# EAGLE design PicoKbd (EAGLE 6.5.0)
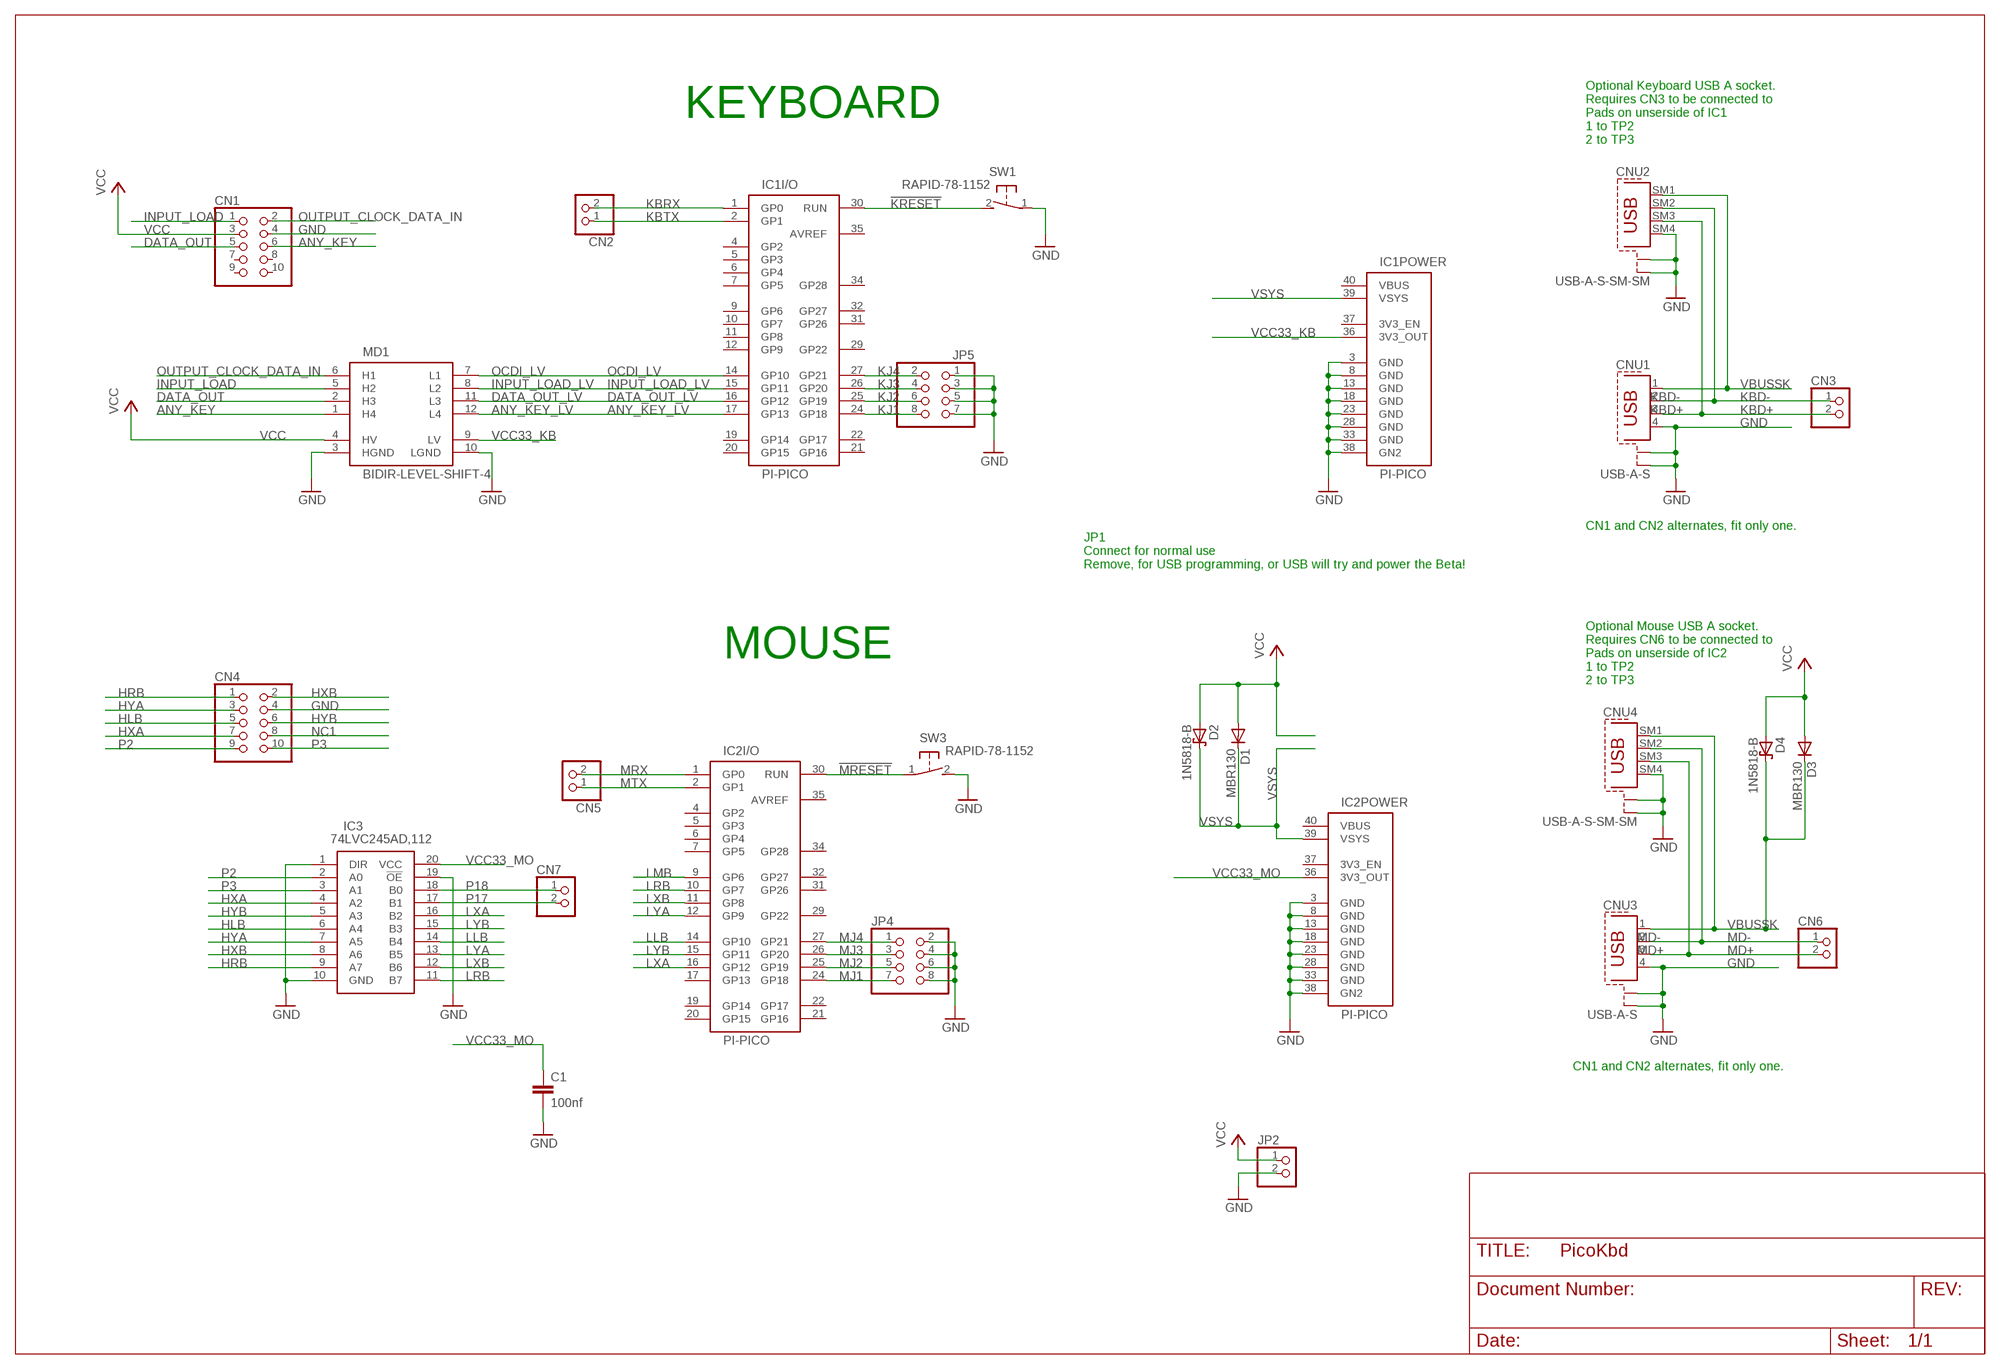
[diagram p0: schematic, sheet 1]

## Parts
C1  100nf  C-EU025-025X050  [C025-025X050]
CN1  PINHD-2X5/90  [2X05/90]
CN2  PINHD-1X2  [1X02]
CN3  PINHD-1X2  [1X02]
CN4  PINHD-2X5/90  [2X05/90]
CN5  PINHD-1X2  [1X02]
CN6  PINHD-1X2  [1X02]
CN7  PINHD-1X2  [1X02]
CNU1  USB-A-S  [USB-A-SHIELD-PTH]
CNU2  USB-A-S-SM-SM  [USB-A-SHIELD-SM]
CNU3  USB-A-S  [USB-A-SHIELD-PTH]
CNU4  USB-A-S-SM-SM  [USB-A-SHIELD-SM]
D1  MBR130  MBR0520LT  [SOD123]
D2  1N5818-B  [DO41-7.6]
D3  MBR130  MBR0520LT  [SOD123]
D4  1N5818-B  [DO41-7.6]
IC1  PI-PICO  [PI-PICO-MAIN]
IC2  PI-PICO  [PI-PICO-MAIN]
IC3  74LVC245AD,112  [SOIC127P1032X265-20N]
JP2  PINHD-1X2/90  [1X02/90]
JP4  PINHD-2X4  [2X04]
JP5  PINHD-2X4  [2X04]
MD1  BIDIR-LEVEL-SHIFT-4  [BIDIR-LEVEL-SHIFT]
SW1  RAPID-78-1152  [B3F-31XX]
SW3  RAPID-78-1152  [B3F-31XX]

## Nets
!KRESET: IC1.30(I/O:RUN) SW1.2(S)
!MRESET: IC2.30(I/O:RUN) SW3.1(P)
ANY_KEY: CN1.6 MD1.1(H4)
ANY_KEY_LV: IC1.17(I/O:GP13) MD1.12(L4)
DATA_OUT: CN1.5 MD1.2(H3)
DATA_OUT_LV: IC1.16(I/O:GP12) MD1.11(L3)
GND: C1.2 CN1.4 CN4.4 CNU1.4 CNU1.S1 CNU1.S2 CNU2.S1 CNU2.S2 CNU2.SM4 CNU3.4 CNU3.S1 CNU3.S2 CNU4.S1 CNU4.S2 CNU4.SM4 IC1.3(POWER:GND) IC1.8(POWER:GND) IC1.13(POWER:GND) IC1.18(POWER:GND) IC1.23(POWER:GND) IC1.28(POWER:GND) IC1.33(POWER:GND) IC1.38(POWER:GN2) IC2.3(POWER:GND) IC2.8(POWER:GND) IC2.13(POWER:GND) IC2.18(POWER:GND) IC2.23(POWER:GND) IC2.28(POWER:GND) IC2.33(POWER:GND) IC2.38(POWER:GN2) IC3.1(DIR) IC3.10(GND) IC3.19(!OE) JP2.2 JP4.2 JP4.4 JP4.6 JP4.8 JP5.1 JP5.3 JP5.5 JP5.7 MD1.3(HGND) MD1.10(LGND) SW1.1(P) SW3.2(S)
HLB: CN4.5 IC3.6(A4)
HRB: CN4.1 IC3.9(A7)
HXA: CN4.7 IC3.4(A2)
HXB: CN4.2 IC3.8(A6)
HYA: CN4.3 IC3.7(A5)
HYB: CN4.6 IC3.5(A3)
INPUT_LOAD: CN1.1 MD1.5(H2)
INPUT_LOAD_LV: IC1.15(I/O:GP11) MD1.8(L2)
KBD+: CN3.2 CNU1.3 CNU2.SM3
KBD-: CN3.1 CNU1.2 CNU2.SM2
KBRX: CN2.2 IC1.1(I/O:GP0)
KBTX: CN2.1 IC1.2(I/O:GP1)
KJ1: IC1.24(I/O:GP18) JP5.8
KJ2: IC1.25(I/O:GP19) JP5.6
KJ3: IC1.26(I/O:GP20) JP5.4
KJ4: IC1.27(I/O:GP21) JP5.2
LLB: IC2.14(I/O:GP10) IC3.14(B4)
LMB: IC2.9(I/O:GP6)
LRB: IC2.10(I/O:GP7) IC3.11(B7)
LXA: IC2.16(I/O:GP12) IC3.16(B2)
LXB: IC2.11(I/O:GP8) IC3.12(B6)
LYA: IC2.12(I/O:GP9) IC3.13(B5)
LYB: IC2.15(I/O:GP11) IC3.15(B3)
MD+: CN6.2 CNU3.3 CNU4.SM3
MD-: CN6.1 CNU3.2 CNU4.SM2
MJ1: IC2.24(I/O:GP18) JP4.7
MJ2: IC2.25(I/O:GP19) JP4.5
MJ3: IC2.26(I/O:GP20) JP4.3
MJ4: IC2.27(I/O:GP21) JP4.1
MRX: CN5.2 IC2.1(I/O:GP0)
MTX: CN5.1 IC2.2(I/O:GP1)
NC1: CN4.8
OCDI_LV: IC1.14(I/O:GP10) MD1.7(L1)
OUTPUT_CLOCK_DATA_IN: CN1.2 MD1.6(H1)
P2: CN4.9 IC3.2(A0)
P3: CN4.10 IC3.3(A1)
P17: CN7.2 IC3.17(B1)
P18: CN7.1 IC3.18(B0)
VBUSSK: CNU1.1 CNU2.SM1 CNU3.1 CNU4.SM1 D3.C D4.C
VCC: CN1.3 D1.A D2.A D3.A D4.A JP2.1 MD1.4(HV)
VCC33_KB: IC1.36(POWER:3V3_OUT) MD1.9(LV)
VCC33_MO: C1.1 IC2.36(POWER:3V3_OUT) IC3.20(VCC)
VSYS: D1.C D2.C IC1.39(POWER:VSYS) IC2.39(POWER:VSYS)
Unconnected: CN1.7 CN1.8 CN1.9 CN1.10 IC1.4(I/O:GP2) IC1.5(I/O:GP3) IC1.6(I/O:GP4) IC1.7(I/O:GP5) IC1.9(I/O:GP6) IC1.10(I/O:GP7) IC1.11(I/O:GP8) IC1.12(I/O:GP9) IC1.19(I/O:GP14) IC1.20(I/O:GP15) IC1.21(I/O:GP16) IC1.22(I/O:GP17) IC1.29(I/O:GP22) IC1.31(I/O:GP26) IC1.32(I/O:GP27) IC1.34(I/O:GP28) IC1.35(I/O:AVREF) IC1.37(POWER:3V3_EN) IC1.40(POWER:VBUS) IC2.4(I/O:GP2) IC2.5(I/O:GP3) IC2.6(I/O:GP4) IC2.7(I/O:GP5) IC2.17(I/O:GP13) IC2.19(I/O:GP14) IC2.20(I/O:GP15) IC2.21(I/O:GP16) IC2.22(I/O:GP17) IC2.29(I/O:GP22) IC2.31(I/O:GP26) IC2.32(I/O:GP27) IC2.34(I/O:GP28) IC2.35(I/O:AVREF) IC2.37(POWER:3V3_EN) IC2.40(POWER:VBUS) SW1.3(BD1) SW1.4(BD2) SW3.3(BD1) SW3.4(BD2)

## Notes on the sheet
- KEYBOARD
- Optional Keyboard USB A socket.
  Requires CN3 to be connected to 
  Pads on unserside of IC1
  1 to TP2
  2 to TP3
- CN1 and CN2 alternates, fit only one.
- JP1
  Connect for normal use
  Remove, for USB programming, or USB will try and power the Beta!
- MOUSE
- Optional Mouse USB A socket.
  Requires CN6 to be connected to 
  Pads on unserside of IC2
  1 to TP2
  2 to TP3
- CN1 and CN2 alternates, fit only one.

## Library data of the parts
C1 = rcl:C-EU: CAPACITOR, European symbol
CN1 CN4 = pinhead-round:PINHD-2X5: PIN HEADER
CN2 CN3 CN5-CN7 JP2 = pinhead-round:PINHD-1X2: PIN HEADER
CNU1 CNU3 = Con-usb:USB-A-S
CNU2 CNU4 = Con-usb:USB-A-S-SM
D1 D3 = diode:MBR0520LT: SCHOTTKY BARRIER RECTIFIER Source: http://onsemi.com .. MBR0520LT1-D.pdf
D2 D4 = diode:1N581*: 1.0A SCHOTTKY BARRIER RECTIFIER Source: http://www.diodes.com/datasheets/ds23001.pdf
IC1 IC2 = RapberryPi:PI-PICO
IC3 = SamacSys_Parts:74LVC245AD,112: NXP 74LVC245AD,112, Bus Transceiver, 8-Bit Non-Inverting LVTTL, 1.2 3.6 V, 20-Pin SOIC Source: Datasheet <http://uk.rs-online.com/web/p/products/3800279P>; DESCRIPTION: NXP 74LVC245AD,112, Bus Transceiver, 8-Bit Non-Inverting LVTTL, 1.2 3.6 V, 20-Pin SOIC; HEIGHT: 2.65mm; MANUFACTURER_NAME: Nexperia; MANUFACTURER_PART_NUMBER: 74LVC245AD,112; RS_PART_NUMBER: 3800279P; RS_PRICE-STOCK: http://uk.rs-online.com/web/p/products/3800279P
JP4 JP5 = pinhead-round:PINHD-2X4: PIN HEADER
MD1 = Misc:BIDIR-LEVEL-SHIFT-4: 4 Channel bidirectional level shifter
SW1 SW3 = Switches_phs:RAPID-78-1152

## Board
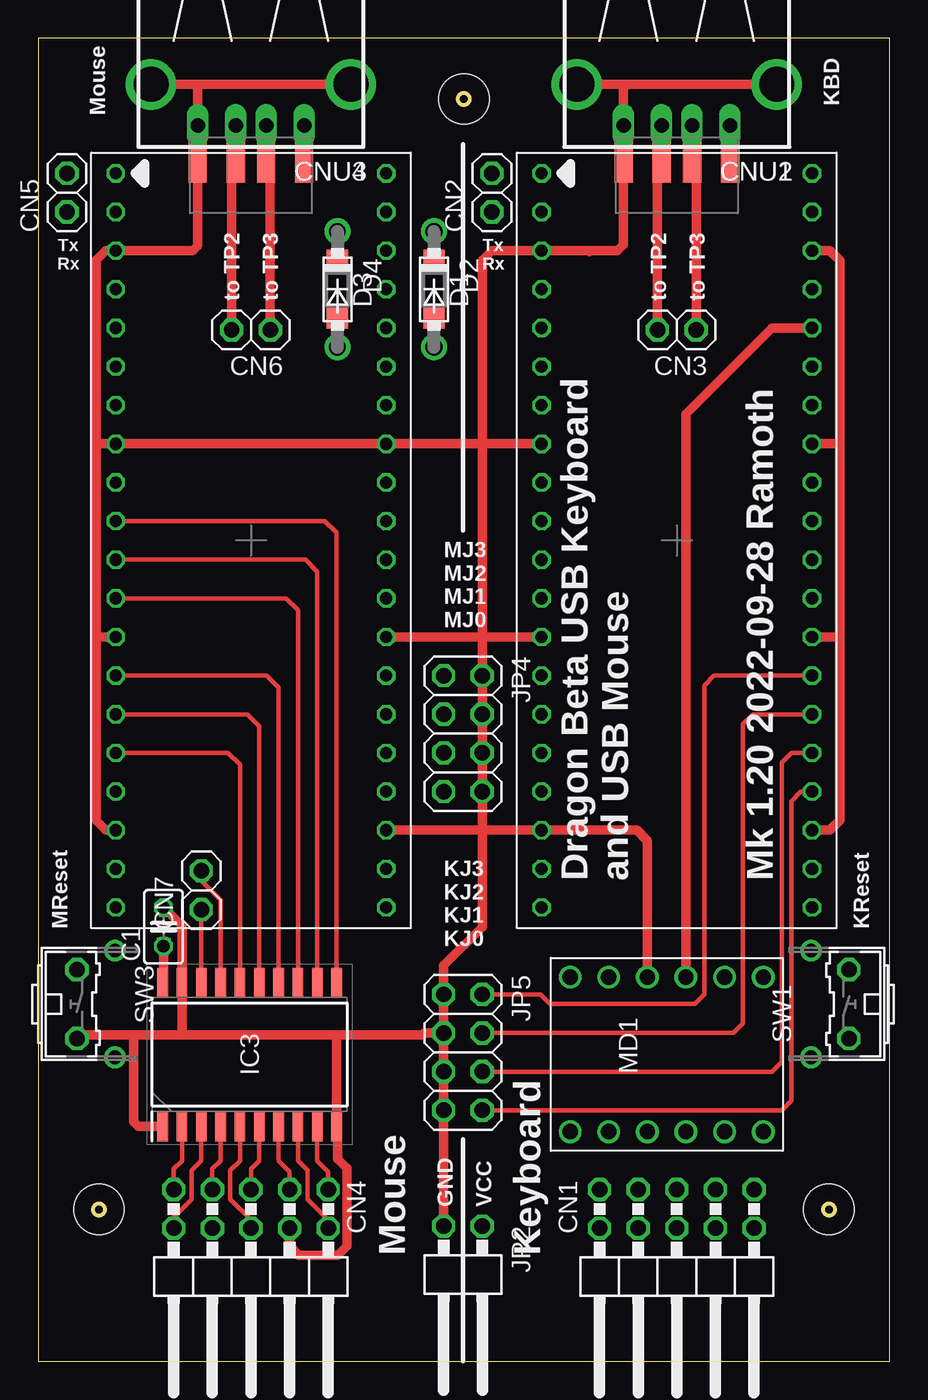
[diagram p1: board, top side]
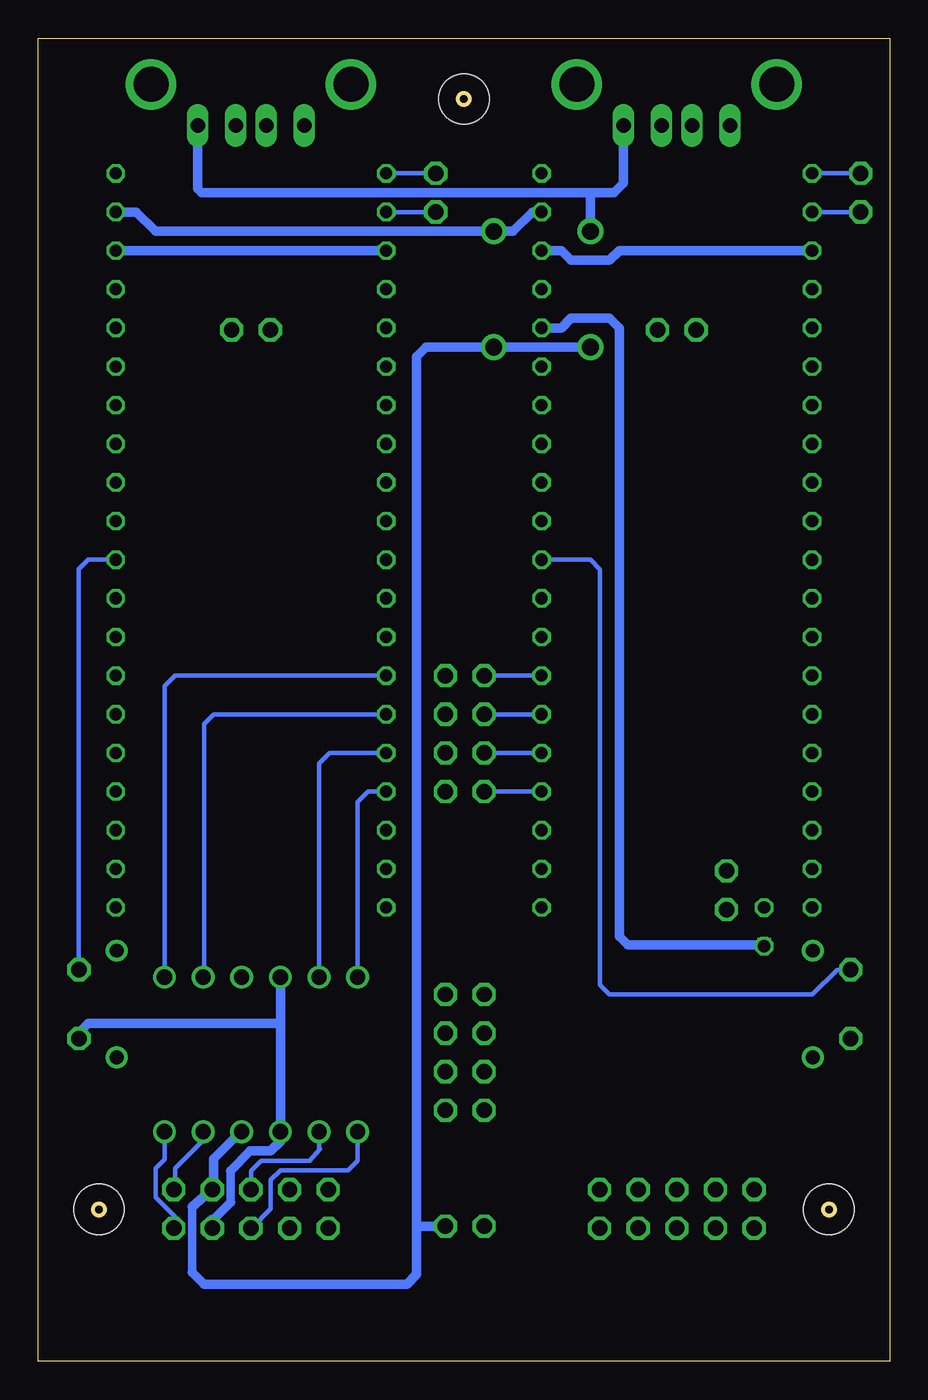
[diagram p2: board, bottom side, seen from below]

Size 56 x 87 mm. Coordinates in mm from the lower left corner, seen from the top.
Outline: 0,0 56,0 56,87 0,87 0,0
Copper layers (1*16): Top 0.035559375mm / dielectric 1.6mm / Bottom 0.035559375mm
Design rules "oshpark-2layer": minimum track width 6mil, minimum drill 10mil, track to track 6mil, track to pad 6mil, pad to pad 6mil, via to via 6mil, smd to smd 6mil, copper to edge 15mil, drill to drill 6mil, minimum pad ring 5mil, minimum via ring 5mil, stop-mask expansion 2.5mil, vias tented up to drill 0mil, thermal gap 10mil

### Footprints (pad centres in the part's own frame; a part is rotated, then mirrored left to right if it is on the bottom)
C025-025X050 = drill 0.813 octagon: 1 -1.27,0; 2 1.27,0
2X05/90 = drill 1.016 octagon: 1 -5.08,-6.35; 2 -5.08,-3.81; 3 -2.54,-6.35; 4 -2.54,-3.81; 5 0,-6.35; 6 0,-3.81; 7 2.54,-6.35; 8 2.54,-3.81; 9 5.08,-6.35; 10 5.08,-3.81
1X02 = drill 1.016 octagon: 1 -1.27,0; 2 1.27,0
USB-A-SHIELD-PTH = drill 0.95 long: 1 -3.5,5.25; 2 -1,5.25; 3 1,5.25; 4 3.5,5.25 | drill 2.3 pad 2.9: S1 -6.57,2.54; S2 6.57,2.54
USB-A-SHIELD-SM = drill 2.3 pad 2.9: S1 -6.57,2.54; S2 6.57,2.54 | smd 1.2 x 3: SM1 -3.5,7.5; SM2 -1,7.5; SM3 1,7.5; SM4 3.5,7.5
SOD123 = smd 1.4 x 1.4: A 1.9,0; C -1.9,0
DO41-7.6 = drill 1.1 pad 1.7: A 3.81,0; C -3.81,0
PI-PICO-MAIN = drill 0.8 octagon: 1 -24.13,-8.89; 2 -21.59,-8.89; 3 -19.05,-8.89; 4 -16.51,-8.89; 5 -13.97,-8.89; 6 -11.43,-8.89; 7 -8.89,-8.89; 8 -6.35,-8.89; 9 -3.81,-8.89; 10 -1.27,-8.89; 11 1.27,-8.89; 12 3.81,-8.89; 13 6.35,-8.89; 14 8.89,-8.89; 15 11.43,-8.89; 16 13.97,-8.89; 17 16.51,-8.89; 18 19.05,-8.89; 19 21.59,-8.89; 20 24.13,-8.89; 21 24.13,8.89; 22 21.59,8.89; 23 19.05,8.89; 24 16.51,8.89; 25 13.97,8.89; 26 11.43,8.89; 27 8.89,8.89; 28 6.35,8.89; 29 3.81,8.89; 30 1.27,8.89; 31 -1.27,8.89; 32 -3.81,8.89; 33 -6.35,8.89; 34 -8.89,8.89; 35 -11.43,8.89; 36 -13.97,8.89; 37 -16.51,8.89; 38 -19.05,8.89; 39 -21.59,8.89; 40 -24.13,8.89
SOIC127P1032X265-20N = smd 1.95 x 0.7: 1 -4.725,5.715; 2 -4.725,4.445; 3 -4.725,3.175; 4 -4.725,1.905; 5 -4.725,0.635; 6 -4.725,-0.635; 7 -4.725,-1.905; 8 -4.725,-3.175; 9 -4.725,-4.445; 10 -4.725,-5.715; 11 4.725,-5.715; 12 4.725,-4.445; 13 4.725,-3.175; 14 4.725,-1.905; 15 4.725,-0.635; 16 4.725,0.635; 17 4.725,1.905; 18 4.725,3.175; 19 4.725,4.445; 20 4.725,5.715
1X02/90 = drill 1.016 octagon: 1 -1.27,-3.81; 2 1.27,-3.81
2X04 = drill 1.016 octagon: 1 -3.81,-1.27; 2 -3.81,1.27; 3 -1.27,-1.27; 4 -1.27,1.27; 5 1.27,-1.27; 6 1.27,1.27; 7 3.81,-1.27; 8 3.81,1.27
BIDIR-LEVEL-SHIFT = drill 1: 1 -5.08,6.35; 2 -5.08,3.81; 3 -5.08,1.27; 4 -5.08,-1.27; 5 -5.08,-3.81; 6 -5.08,-6.35; 7 5.08,-6.35; 8 5.08,-3.81; 9 5.08,-1.27; 10 5.08,1.27; 11 5.08,3.81; 12 5.08,6.35
B3F-31XX = drill 1.016 octagon: 1 -2.261,-1.245; 2 2.261,-1.245 | drill 0.9 pad 1.422: 3 -3.505,1.245; 4 3.505,1.245
STAND-OFF = hole 3.302: 0,0

### Placement (x,y rotation side)
C1  8.26,28.57 90 top
CN1  42,4.95 180 top
CN2  29.84,76.83 90 top
CN3  42,67.81 180 top
CN4  14,4.95 180 top
CN5  1.91,76.83 90 top
CN6  14,67.81 180 top
CN7  10.73,30.98 90 top
CNU1  42,86.5 180 top
CNU2  42,86.5 180 top
CNU3  14,86.5 180 top
CNU4  14,86.5 180 top
D1  26.04,70.48 270 top
D2  26.04,70.48 270 top
D3  19.68,70.48 270 top
D4  19.68,70.48 270 top
IC1  42,53.98 270 top
IC2  14,53.98 270 top
IC3  13.91,20.18 90 top
JP2  27.94,5.08 180 top
JP4  27.94,41.27 270 top
JP5  27.94,20.32 270 top
MD1  41.34,20.18 90 top
SW1  52.07,23.5 90 top
SW3  3.81,23.5 270 top
U$1  [STAND-OFF]  4,10 0 top
U$3  [STAND-OFF]  52,10 0 top
U$4  [STAND-OFF]  28,83 0 top

### Tracks (layer width: path | path; a pad name or v marks a point on that pad's centre or on a via)
!KRESET
  Bottom 0.305: SW1.2 53.31,52.09 52.7,52.7 IC1.30
!MRESET
  Bottom 0.305: SW3.1 3.45,25.76 5.08,24.13 18.41,24.13 19.05,24.77 19.05,52.07 19.68,52.7 IC2.30
ANY_KEY
  Bottom 0.305: CN1.6 41.97,8.76 40.7,10.03 40.7,11.93 40.06,12.56 35.62,12.56 34.98,13.2 MD1.1
ANY_KEY_LV
  Bottom 0.305: MD1.12 34.98,36.77 34.29,37.47 IC1.17
DATA_OUT
  Bottom 0.305: CN1.5 42,12.54 41.34,13.2 38.16,13.2 37.47,13.97 37.52,14.03 MD1.2
DATA_OUT_LV
  Bottom 0.305: IC1.16 36.83,40.01 37.52,39.31 MD1.11
GND
  Top 0.61: 19.62,21.45 IC3.10 19.68,15.4 19.68,13.34 20.32,12.7 20.32,7.62 19.68,6.99 17.14,6.99 16.54,7.59 CN4.4 | 19.62,21.45 9.46,21.45 | 9.46,21.45 IC3.19 9.46,28.64 C1.2 | 9.46,21.45 6.29,21.45 | IC3.1 6.57,15.46 6.29,15.74 6.29,21.45 | CNU2.S2 38.8,83.96 | 38.8,83.96 CNU2.S1 | 38.8,83.96 38.5,83.67 CNU1.4 CNU2.SM4 38.5,73.42 38.1,73.03 36.2,73.03 | CNU4.S2 10.73,83.96 | 10.73,83.96 CNU4.S1 | 10.73,83.96 10.5,83.72 CNU3.4 CNU4.SM4 10.5,73.36 10.16,73.03 IC2.3 4.45,73.03 3.81,72.39 3.81,60.33 | MD1.10 40.06,34.23 39.37,34.92 IC1.18 29.21,34.92 | IC2.28 29.21,47.62 | 29.21,47.62 JP4.2 JP4.4 JP4.6 JP4.8 29.21,34.92 | 36.2,73.03 IC1.3 29.84,73.03 29.21,72.39 29.21,60.33 | 36.26,72.97 36.2,73.03 | IC1.23 52.07,34.92 52.7,35.56 52.7,47.62 | 52.7,47.62 52.7,60.33 | 52.7,60.33 52.7,72.39 52.07,73.03 IC1.38 | IC1.33 52.7,60.33 | IC1.28 52.7,47.62 | 6.29,21.45 2.79,21.45 SW3.2 | 19.62,21.45 25.27,21.45 25.4,21.59 JP5.3 | JP5.3 JP5.1 26.67,26.04 29.21,28.57 29.21,34.92 | JP5.3 JP5.5 JP5.7 JP2.2 | IC2.23 29.21,34.92 | IC1.13 29.21,47.62 | 29.21,47.62 29.21,60.33 | IC1.8 29.21,60.33 | IC2.18 4.45,34.92 3.81,35.56 3.81,47.62 | 3.81,47.62 3.81,60.33 | 3.81,60.33 IC2.8 IC2.33 29.21,60.33 | IC2.13 3.81,47.62
  Bottom 0.559: 43.34,10.48 43.34,12.54
  Bottom 0.61: CN1.4 44.54,9.36 44.46,9.36 43.34,10.48 | IC1.38 IC1.3 | 40.06,22.23 MD1.3 40.06,14.47 40.7,13.84 42.05,13.84 43.34,12.54 | 40.06,22.23 MD1.10 | SW1.1 53.31,21.61 52.7,22.23 40.06,22.23 | IC2.38 21.59,73.03 20.95,72.39 18.41,72.39 17.78,73.03 IC2.3
HLB
  Top 0.305: CN4.5 14,12.65 14.54,13.2 IC3.6
HRB
  Top 0.305: CN4.1 19.08,12.47 18.36,13.2 IC3.9
HXA
  Top 0.305: CN4.7 11.46,12.65 12.01,13.2 IC3.4
HXB
  Top 0.305: CN4.2 19.08,9.3 17.72,10.66 17.72,12.56 17.09,13.2 IC3.8
HYA
  Top 0.305: CN4.3 16.54,12.47 15.81,13.2 IC3.7
HYB
  Top 0.305: CN4.6 14,9.3 12.64,10.66 12.64,12.56 13.28,13.2 IC3.5
INPUT_LOAD
  Bottom 0.305: MD1.5 45.15,14.54 46.99,12.7 46.99,11.38 CN1.1
INPUT_LOAD_LV
  Bottom 0.305: IC1.15 44.45,42.55 45.09,41.91 45.09,25.32 MD1.8
KBD+
  Top 0.61: CNU1.3 CNU2.SM3 40.73,78.73 CN3.2
KBD-
  Top 0.61: CNU1.2 43.24,81.01 43.24,79.88 43,79.64 CNU2.SM2 43.27,78.73 CN3.1
KBRX
  Bottom 0.305: CN2.2 IC1.1
KBTX
  Bottom 0.305: CN2.1 IC1.2
KJ1
  Top 0.305: JP5.8 48.9,16.51 49.53,17.14 49.53,36.83 50.16,37.47 IC1.24
KJ2
  Top 0.305: JP5.6 48.26,19.05 48.9,19.68 48.9,39.37 49.53,40.01 IC1.25
KJ3
  Top 0.305: JP5.4 45.72,21.59 46.35,22.23 46.35,41.91 46.99,42.55 IC1.26
KJ4
  Top 0.305: JP5.2 33.02,24.13 33.66,23.5 43.18,23.5 43.81,24.13 43.81,44.45 44.45,45.09 IC1.27
LLB
  Top 0.305: IC3.14 15.81,44.31 15.04,45.09 IC2.14
LRB
  Top 0.305: IC3.11 19.62,54.48 18.86,55.24 IC2.10
LXA
  Top 0.305: IC3.16 13.28,39.23 12.51,40.01 IC2.16
LXB
  Top 0.305: IC3.12 18.36,51.94 17.59,52.7 IC2.11
LYA
  Top 0.305: IC3.13 17.09,49.4 16.32,50.16 IC2.12
LYB
  Top 0.305: IC3.15 14.54,41.77 13.78,42.55 IC2.15
MD+
  Top 0.61: CNU3.3 CNU4.SM3 12.73,78.73 CN6.2
MD-
  Top 0.61: CNU3.2 CNU4.SM2 15.27,78.73 CN6.1
MJ1
  Bottom 0.305: JP4.7 IC2.24
MJ2
  Bottom 0.305: IC2.25 JP4.5
MJ3
  Bottom 0.305: JP4.3 IC2.26
MJ4
  Bottom 0.305: IC2.27 JP4.1
MRX
  Bottom 0.305: CN5.2 IC2.1
MTX
  Bottom 0.305: CN5.1 IC2.2
OCDI_LV
  Bottom 0.305: MD1.7 47.69,44.39 46.99,45.09 IC1.14
OUTPUT_CLOCK_DATA_IN
  Bottom 0.305: MD1.6 47.69,13.28 48.26,12.7 48.26,10.79 46.99,9.53 46.99,8.85 CN1.2
P2
  Top 0.305: CN4.9 8.92,12.65 9.46,13.2 IC3.2
P3
  Top 0.305: CN4.10 8.92,9.3 8.83,9.39 10.1,10.66 10.1,12.56 10.73,13.2 IC3.3
P17
  Top 0.305: IC3.17 12.01,30.34 10.73,31.61 CN7.2
P18
  Top 0.305: CN7.1 IC3.18
VBUSSK
  Top 0.61: CNU2.SM1 CNU1.1 | CNU3.1 CNU4.SM1 | D4.C D3.C
  Bottom 0.61: D4.C 19.66,76.83 19.66,76.81 19.68,76.83 | 19.68,76.83 18.14,76.83 17.5,77.47 CNU3.1 | 19.68,76.83 45.24,76.83 45.5,77.09 CNU1.1
VCC
  Top 0.61: D3.A D4.A | D1.A D2.A
  Bottom 0.559: 45.88,10.16 45.88,5.87
  Bottom 0.61: 45.88,10.16 44.59,11.29 CN1.3 44.45,11.38 44.45,13.34 42.68,15.11 MD1.4 | 45.88,5.87 45.09,5.08 31.75,5.08 31.11,5.71 31.11,8.89 | 31.11,8.89 31.11,66.04 30.48,66.67 D2.A D4.A | JP2.1 31.11,8.89
VCC33_KB
  Top 0.61: MD1.9 42.6,62.29 48.26,67.94 IC1.36
VCC33_MO  (via drill 0.6)
  Top 0.61: IC3.20 8.2,24.82 8.26,24.77 C1.1 v8.26,27.38
  Bottom 0.61: v8.26,27.38 17.22,27.38 17.78,27.94 17.78,67.94 18.41,68.58 20.95,68.58 21.59,67.94 IC2.36
VSYS
  Top 0.61: D1.C D2.C
  Bottom 0.61: 50.89,75.66 IC1.39 49.53,75.56 48.26,74.3 D2.C 24.77,74.3 23.5,75.56 IC2.39

### Text on the board
tPlace: KBD | Mouse | Tx / Rx | Tx / Rx | Tx / Rx | to TP2 | to TP3 | to TP2 | to TP3 | MJ3 / MJ2 / MJ1 / MJ0 | Dragon Beta USB Keyboard / and USB Mouse | Mk 1.20 2022-09-28 Ramoth | MReset | KReset | KJ3 / KJ2 / KJ1 / KJ0 | GND | VCC | Mouse | Keyboard